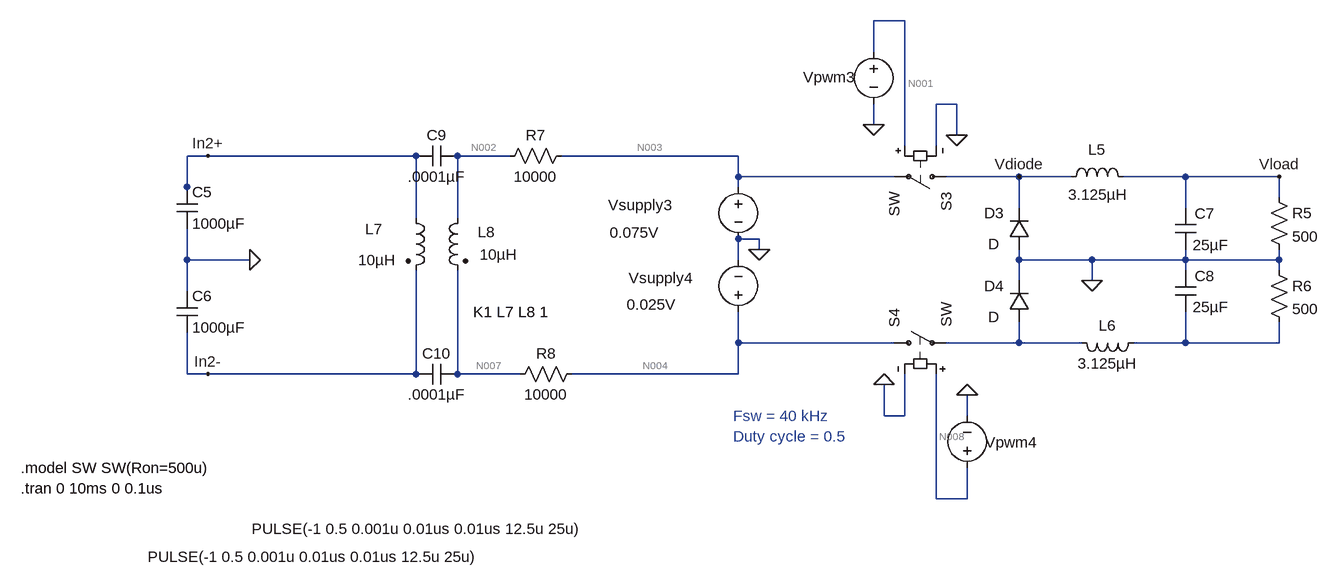
[diagram p0: schematic AC Power Flow ver2.4 (CM-DM Model Appl2) .asc]
AC Power Flow ver2.4 (CM-DM Model Appl2) .asc, the LTspice schematic file:
Version 4
SHEET 1 3264 1352
WIRE 1456 -304 1408 -304
WIRE 1408 -256 1408 -304
WIRE 1536 -176 1504 -176
WIRE 1408 -144 1408 -176
WIRE 1536 -128 1536 -176
WIRE 1456 -112 1456 -304
WIRE 1504 -112 1504 -176
WIRE 384 -96 352 -96
WIRE 704 -96 384 -96
WIRE 848 -96 768 -96
WIRE 1200 -96 928 -96
WIRE 1200 -64 1200 -96
WIRE 1440 -64 1200 -64
WIRE 1632 -64 1520 -64
WIRE 1712 -64 1632 -64
WIRE 1888 -64 1792 -64
WIRE 2032 -64 1888 -64
WIRE 352 -48 352 -96
WIRE 1200 -48 1200 -64
WIRE 352 -32 352 -48
WIRE 2032 -32 2032 -64
WIRE 1632 -16 1632 -64
WIRE 1888 -16 1888 -64
WIRE 704 0 704 -96
WIRE 768 0 768 -96
WIRE 1232 32 1200 32
WIRE 1232 48 1232 32
WIRE 352 64 352 16
WIRE 448 64 352 64
WIRE 1200 64 1200 32
WIRE 1632 64 1632 48
WIRE 1744 64 1632 64
WIRE 1888 64 1888 48
WIRE 1888 64 1744 64
WIRE 2032 64 2032 48
WIRE 2032 64 1888 64
WIRE 1888 80 1888 64
WIRE 2032 80 2032 64
WIRE 1632 96 1632 64
WIRE 1744 96 1744 64
WIRE 352 112 352 64
WIRE 1200 192 1200 144
WIRE 1440 192 1200 192
WIRE 1632 192 1632 160
WIRE 1632 192 1520 192
WIRE 1728 192 1632 192
WIRE 1888 192 1888 144
WIRE 1888 192 1808 192
WIRE 2032 192 2032 160
WIRE 2032 192 1888 192
WIRE 352 240 352 176
WIRE 384 240 352 240
WIRE 704 240 704 80
WIRE 704 240 384 240
WIRE 768 240 768 80
WIRE 864 240 768 240
WIRE 1200 240 1200 192
WIRE 1200 240 944 240
WIRE 1424 304 1424 256
WIRE 1456 304 1456 240
WIRE 1456 304 1424 304
WIRE 1552 304 1552 272
WIRE 1504 432 1504 240
WIRE 1552 432 1552 384
WIRE 1552 432 1504 432
FLAG 448 64 0
FLAG 384 -96 In2+
FLAG 384 240 In2-
FLAG 1536 -128 0
FLAG 2032 -64 Vload
FLAG 1408 -144 0
FLAG 1632 -64 Vdiode
FLAG 1424 256 0
FLAG 1552 272 0
FLAG 1744 96 0
FLAG 1232 48 0
SYMBOL cap 336 -48 R0
SYMATTR InstName C5
SYMATTR Value 1000µF
SYMBOL cap 336 112 R0
SYMATTR InstName C6
SYMATTR Value 1000µF
SYMBOL sw 1536 -64 R90
SYMATTR InstName S3
SYMBOL res 2016 -48 R0
SYMATTR InstName R5
SYMATTR Value 500
SYMBOL diode 1648 48 R180
WINDOW 0 39 56 Left 2
WINDOW 3 46 8 Left 2
SYMATTR InstName D3
SYMBOL ind 1696 -48 R270
WINDOW 0 42 56 VTop 2
WINDOW 3 4 57 VBottom 2
SYMATTR InstName L5
SYMATTR Value 3.125µH
SYMBOL cap 1872 -16 R0
WINDOW 0 30 9 Left 2
WINDOW 3 27 57 Left 2
SYMATTR InstName C7
SYMATTR Value 25µF
SYMBOL voltage 1408 -272 R0
WINDOW 3 -445 750 Right 2
WINDOW 123 0 0 Left 2
WINDOW 39 0 0 Left 2
WINDOW 0 -108 55 Left 2
SYMATTR Value PULSE(-1 0.5 0.001u 0.01us 0.01us 12.5u 25u)
SYMATTR InstName Vpwm3
SYMBOL ind 1824 176 R90
WINDOW 0 5 56 VBottom 2
WINDOW 3 32 56 VTop 2
SYMATTR InstName L6
SYMATTR Value 3.125µH
SYMBOL cap 1872 80 R0
WINDOW 0 30 9 Left 2
WINDOW 3 27 57 Left 2
SYMATTR InstName C8
SYMATTR Value 25µF
SYMBOL res 2016 64 R0
SYMATTR InstName R6
SYMATTR Value 500
SYMBOL diode 1648 160 R180
WINDOW 0 39 56 Left 2
WINDOW 3 46 8 Left 2
SYMATTR InstName D4
SYMBOL sw 1424 192 R270
SYMATTR InstName S4
SYMBOL voltage 1552 400 R180
WINDOW 3 1261 -121 Right 2
WINDOW 123 0 0 Left 2
WINDOW 39 0 0 Left 2
WINDOW 0 -108 55 Left 2
SYMATTR Value PULSE(-1 0.5 0.001u 0.01us 0.01us 12.5u 25u)
SYMATTR InstName Vpwm4
SYMBOL ind2 688 -16 R0
WINDOW 0 -62 33 Left 2
WINDOW 3 -73 80 Left 2
SYMATTR InstName L7
SYMATTR Value 10µH
SYMATTR Type ind
SYMBOL ind2 784 -16 M0
WINDOW 0 -42 37 Left 2
WINDOW 3 -76 72 Left 2
SYMATTR InstName L8
SYMATTR Value 10µH
SYMATTR Type ind
SYMBOL cap 768 -112 R90
WINDOW 0 0 32 VBottom 2
WINDOW 3 32 32 VTop 2
SYMATTR InstName C9
SYMATTR Value .0001µF
SYMBOL cap 768 224 R90
WINDOW 0 0 32 VBottom 2
WINDOW 3 32 32 VTop 2
SYMATTR InstName C10
SYMATTR Value .0001µF
SYMBOL voltage 1200 -64 R0
WINDOW 3 -198 86 Left 2
WINDOW 123 0 0 Left 2
WINDOW 39 0 0 Left 2
WINDOW 0 -200 44 Left 2
SYMATTR Value 0.075V
SYMATTR InstName Vsupply3
SYMBOL voltage 1200 160 R180
WINDOW 3 95 27 Left 2
WINDOW 123 0 0 Left 2
WINDOW 39 0 0 Left 2
WINDOW 0 70 68 Left 2
SYMATTR Value 0.025V
SYMATTR InstName Vsupply4
SYMBOL res 832 -80 R270
WINDOW 0 32 56 VTop 2
WINDOW 3 0 56 VBottom 2
SYMATTR InstName R7
SYMATTR Value 10000
SYMBOL res 848 256 R270
WINDOW 0 32 56 VTop 2
WINDOW 3 0 56 VBottom 2
SYMATTR InstName R8
SYMATTR Value 10000
TEXT 96 416 Left 2 !.tran 0 10ms 0 0.1us
TEXT 96 384 Left 2 !.model SW SW(Ron=500u)
TEXT 1192 304 Left 2 ;Fsw = 40 kHz
TEXT 1192 336 Left 2 ;Duty cycle = 0.5
TEXT 792 144 Left 2 !K1 L7 L8 1

The netlist it stands for:
* AC Power Flow ver2.4 (CM-DM Model Appl2) .asc
C5 In2+ 0 1000µF
C6 0 In2- 1000µF
S3 Vdiode N003 N001 0 SW
R5 Vload 0 500
D3 0 Vdiode D
L5 Vdiode Vload 3.125µH
C7 Vload 0 25µF
Vpwm3 N001 0 PULSE(-1 0.5 0.001u 0.01us 0.01us 12.5u 25u)
L6 N006 N005 3.125µH
C8 0 N006 25µF
R6 0 N006 500
D4 N005 0 D
S4 N004 N005 N008 0 SW
Vpwm4 N008 0 PULSE(-1 0.5 0.001u 0.01us 0.01us 12.5u 25u)
L7 In2+ In2- 10µH
L8 N002 N007 10µH
C9 N002 In2+ .0001µF
C10 N007 In2- .0001µF
Vsupply3 N003 0 0.075V
Vsupply4 N004 0 0.025V
R7 N002 N003 10000
R8 N007 N004 10000
.model D D
.lib standard.dio
.tran 0 10ms 0 0.1us
.model SW SW(Ron=500u)
* Fsw = 40 kHz
* Duty cycle = 0.5
K1 L7 L8 1
.backanno
.end

* Results of the author's LTspice run, read from the files saved beside the schematic
* Operating Point, zero values left out:
*   V(n003) = 75 mV
*   V(n001) = -1 V
*   V(n004) = 25 mV
*   V(n008) = -1 V
*   V(n002) = 50 mV
*   V(n007) = 50 mV
*   I(L8) = 2.5 µA
*   I(R8) = 2.5 µA
*   I(R7) = -2.5 µA
*   I(Vsupply4) = 2.5 µA
*   I(Vsupply3) = -2.5 µA